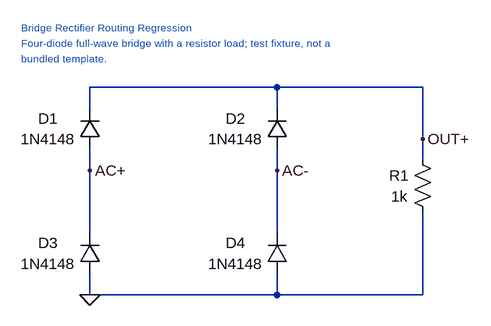
[diagram p0: schematic bridge_rectifier.asc]
bridge_rectifier.asc, the LTspice schematic file:
Version 4
SHEET 1 752 512
SYMBOL diode 240 288 R180
WINDOW 0 80 48 Center 2
WINDOW 3 80 16 Center 2
SYMATTR InstName D1
SYMATTR Value 1N4148
SYMBOL diode 528 288 R180
WINDOW 0 80 48 Center 2
WINDOW 3 80 16 Center 2
SYMATTR InstName D2
SYMATTR Value 1N4148
SYMBOL diode 240 480 R180
WINDOW 0 80 48 Center 2
WINDOW 3 80 16 Center 2
SYMATTR InstName D3
SYMATTR Value 1N4148
SYMBOL diode 528 480 R180
WINDOW 0 80 48 Center 2
WINDOW 3 80 16 Center 2
SYMATTR InstName D4
SYMATTR Value 1N4148
SYMBOL res 720 288 R0
WINDOW 0 -20 40 Center 2
WINDOW 3 -20 72 Center 2
SYMATTR InstName R1
SYMATTR Value 1k
WIRE 224 192 224 224
WIRE 224 192 512 192
WIRE 224 288 224 320
WIRE 224 320 224 416
WIRE 224 480 224 512
WIRE 224 512 512 512
WIRE 512 192 512 224
WIRE 512 192 736 192
WIRE 512 288 512 320
WIRE 512 320 512 416
WIRE 512 480 512 512
WIRE 512 512 736 512
WIRE 736 192 736 272
WIRE 736 272 736 304
WIRE 736 384 736 512
FLAG 224 512 0
FLAG 224 320 AC+
FLAG 512 320 AC-
FLAG 736 272 OUT+
TEXT 118 100 Left 1 ;Bridge Rectifier Routing Regression
TEXT 118 124 Left 1 ;Four-diode full-wave bridge with a resistor load; test fixture, not a
TEXT 118 148 Left 1 ;bundled template.

The netlist it stands for:
* bridge_rectifier.asc
D1 AC+ OUT+ 1N4148
D2 AC- OUT+ 1N4148
D3 0 AC+ 1N4148
D4 0 AC- 1N4148
R1 OUT+ 0 1k
.model D D
.lib standard.dio
* Bridge Rectifier Routing Regression
* Four-diode full-wave bridge with a resistor load; test fixture, not a
* bundled template.
.backanno
.end